# EAGLE schematic dual_sampler-GND-added (EAGLE 8.3.2)
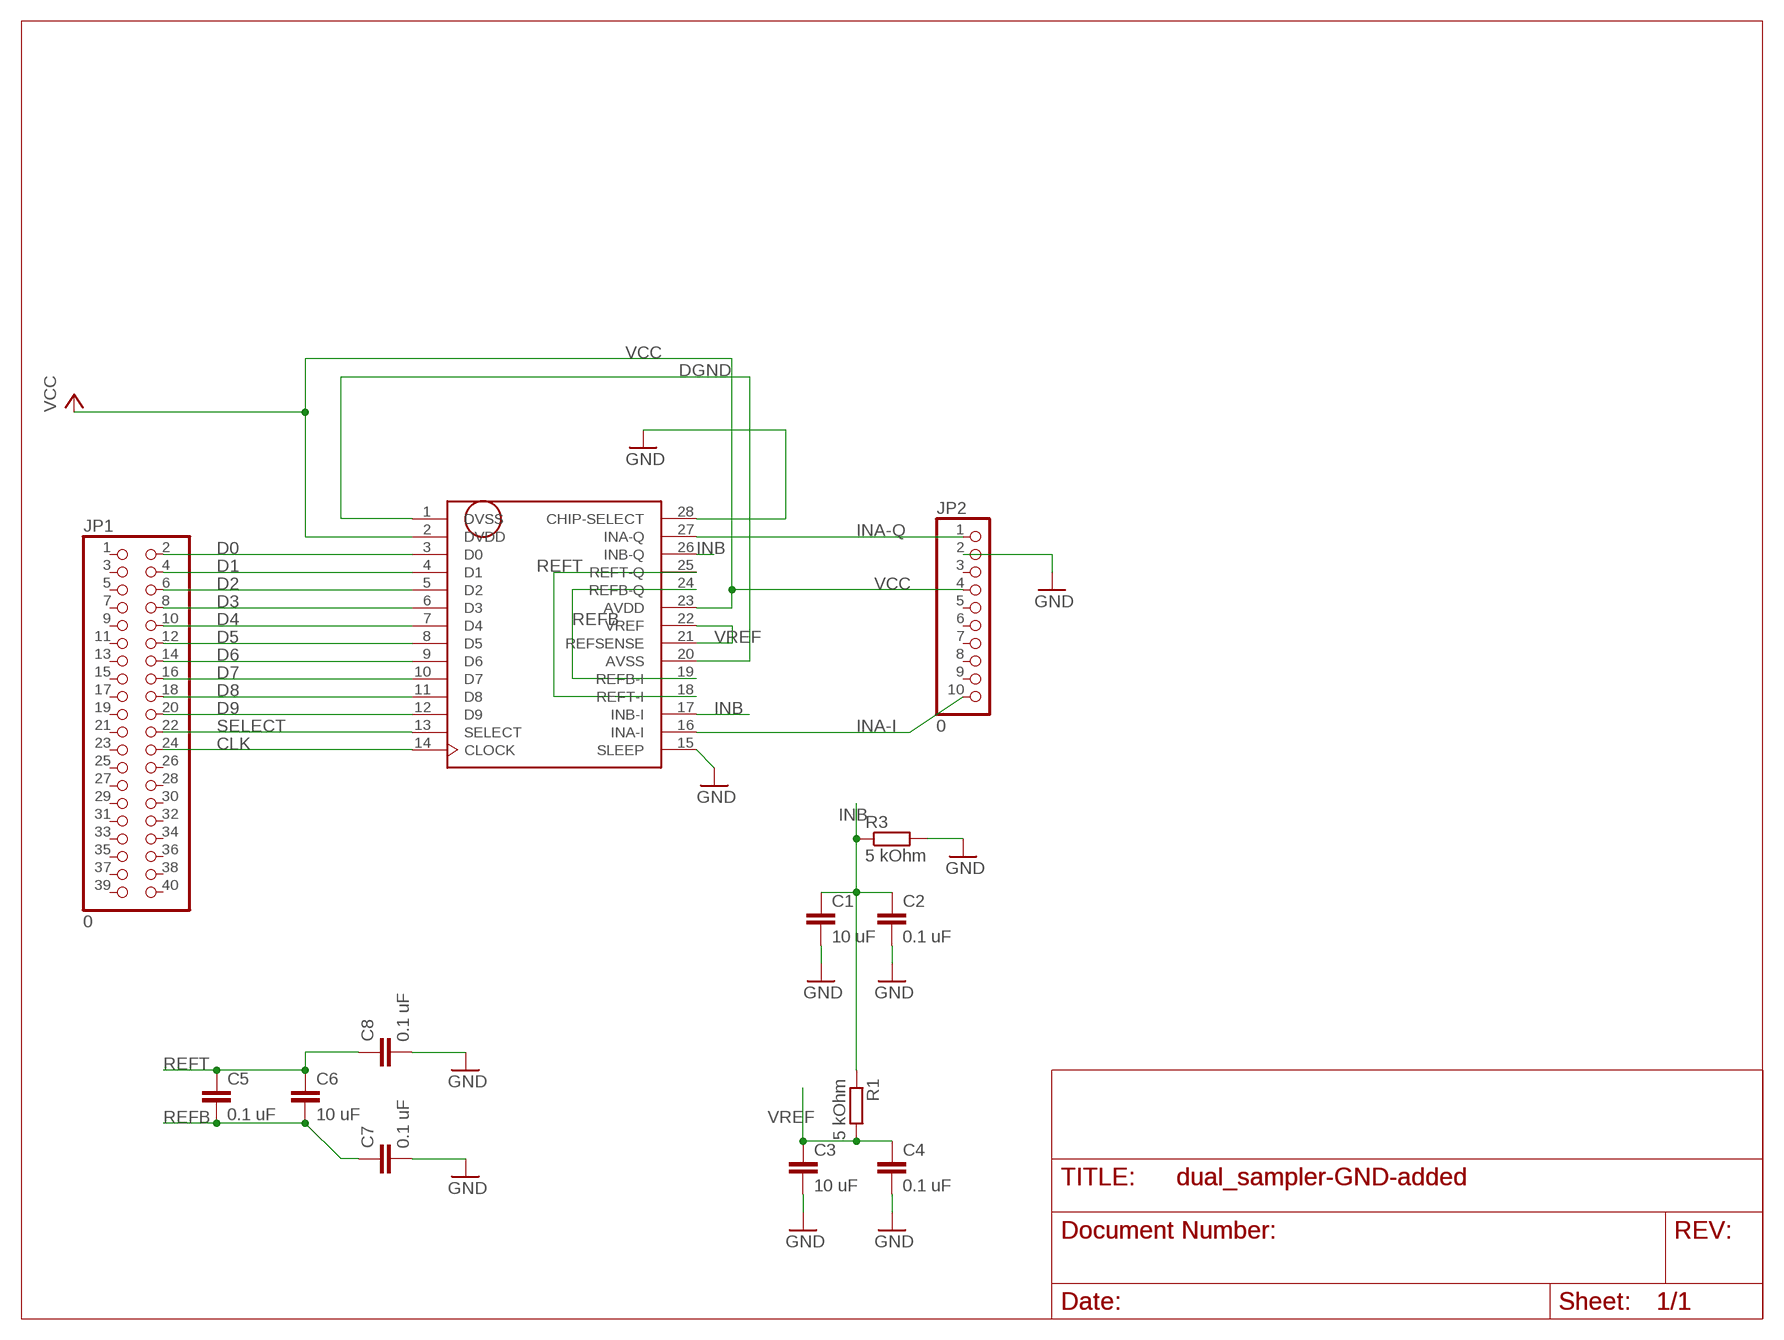
[diagram p0: schematic, sheet 1]

## Parts
C1  10 uF  C2,5-3  [C2.5-3]
C2  0.1 uF  C2,5-3  [C2.5-3]
C3  10 uF  C2,5-3  [C2.5-3]
C4  0.1 uF  C2,5-3  [C2.5-3]
C5  0.1 uF  C2,5-3  [C2.5-3]
C6  10 uF  C2,5-3  [C2.5-3]
C7  0.1 uF  C2,5-3  [C2.5-3]
C8  0.1 uF  C2,5-3  [C2.5-3]
JP1  0  PINHD-2X20  [2X20]
JP2  0  PINHD-1X10  [1X10]
R1  5 kOhm  R-EU_0204/7  [0204/7]
R3  5 kOhm  R-EU_0204/7  [0204/7]
U$1  AD9201ARSZ  [SSOP28]

## Nets
CLK: JP1.24 U$1.14(CLOCK)
D0: JP1.2 U$1.3(D0)
D1: JP1.4 U$1.4(D1)
D2: JP1.6 U$1.5(D2)
D3: JP1.8 U$1.6(D3)
D4: JP1.10 U$1.7(D4)
D5: JP1.12 U$1.8(D5)
D6: JP1.14 U$1.9(D6)
D7: JP1.16 U$1.10(D7)
D8: JP1.18 U$1.11(D8)
D9: JP1.20 U$1.12(D9)
DGND: U$1.1(DVSS) U$1.20(AVSS)
GND: C1.2 C2.2 C3.2 C4.2 C7.2 C8.2 JP2.2 R3.2 U$1.15(SLEEP) U$1.28(CHIP-SELECT)
INA-I: JP2.10 U$1.16(INA-I)
INA-Q: JP2.1 U$1.27(INA-Q)
INB: C1.1 C2.1 R1.1 R3.1 U$1.17(INB-I) U$1.26(INB-Q)
REFB: C5.2 C6.2 C7.1 U$1.19(REFB-I) U$1.24(REFB-Q)
REFT: C5.1 C6.1 C8.1 U$1.18(REFT-I) U$1.25(REFT-Q)
SELECT: JP1.22 U$1.13(SELECT)
VCC: JP2.4 U$1.2(DVDD) U$1.23(AVDD)
VREF: C3.1 C4.1 R1.2 U$1.21(REFSENSE) U$1.22(VREF)
Unconnected: JP1.1 JP1.3 JP1.5 JP1.7 JP1.9 JP1.11 JP1.13 JP1.15 JP1.17 JP1.19 JP1.21 JP1.23 JP1.25 JP1.26 JP1.27 JP1.28 JP1.29 JP1.30 JP1.31 JP1.32 JP1.33 JP1.34 JP1.35 JP1.36 JP1.37 JP1.38 JP1.39 JP1.40 JP2.3 JP2.5 JP2.6 JP2.7 JP2.8 JP2.9

## Library data of the parts
C1-C8 = capacitor-wima:C: CAPACITOR naming: grid - package width
JP1 = pinhead:PINHD-2X20: PIN HEADER
JP2 = pinhead:PINHD-1X10: PIN HEADER
R1 R3 = resistor:R-EU_: RESISTOR, European symbol
U$1 = sampler_lib:AD9201ARSZ: 20 MSPS 10 bit adc http://www.analog.com/media/en/technical-documentation/data-sheets/AD9201.pdf